# Altium schematic sheet Mechanical and Interconnect.SchDoc: Mechanical & Interconnect
size 420 x 297 mm; Address1: CryptUS; Address3: Pascal-Emmanuel Lachance; SheetNumber: 3; SheetTotal: 12
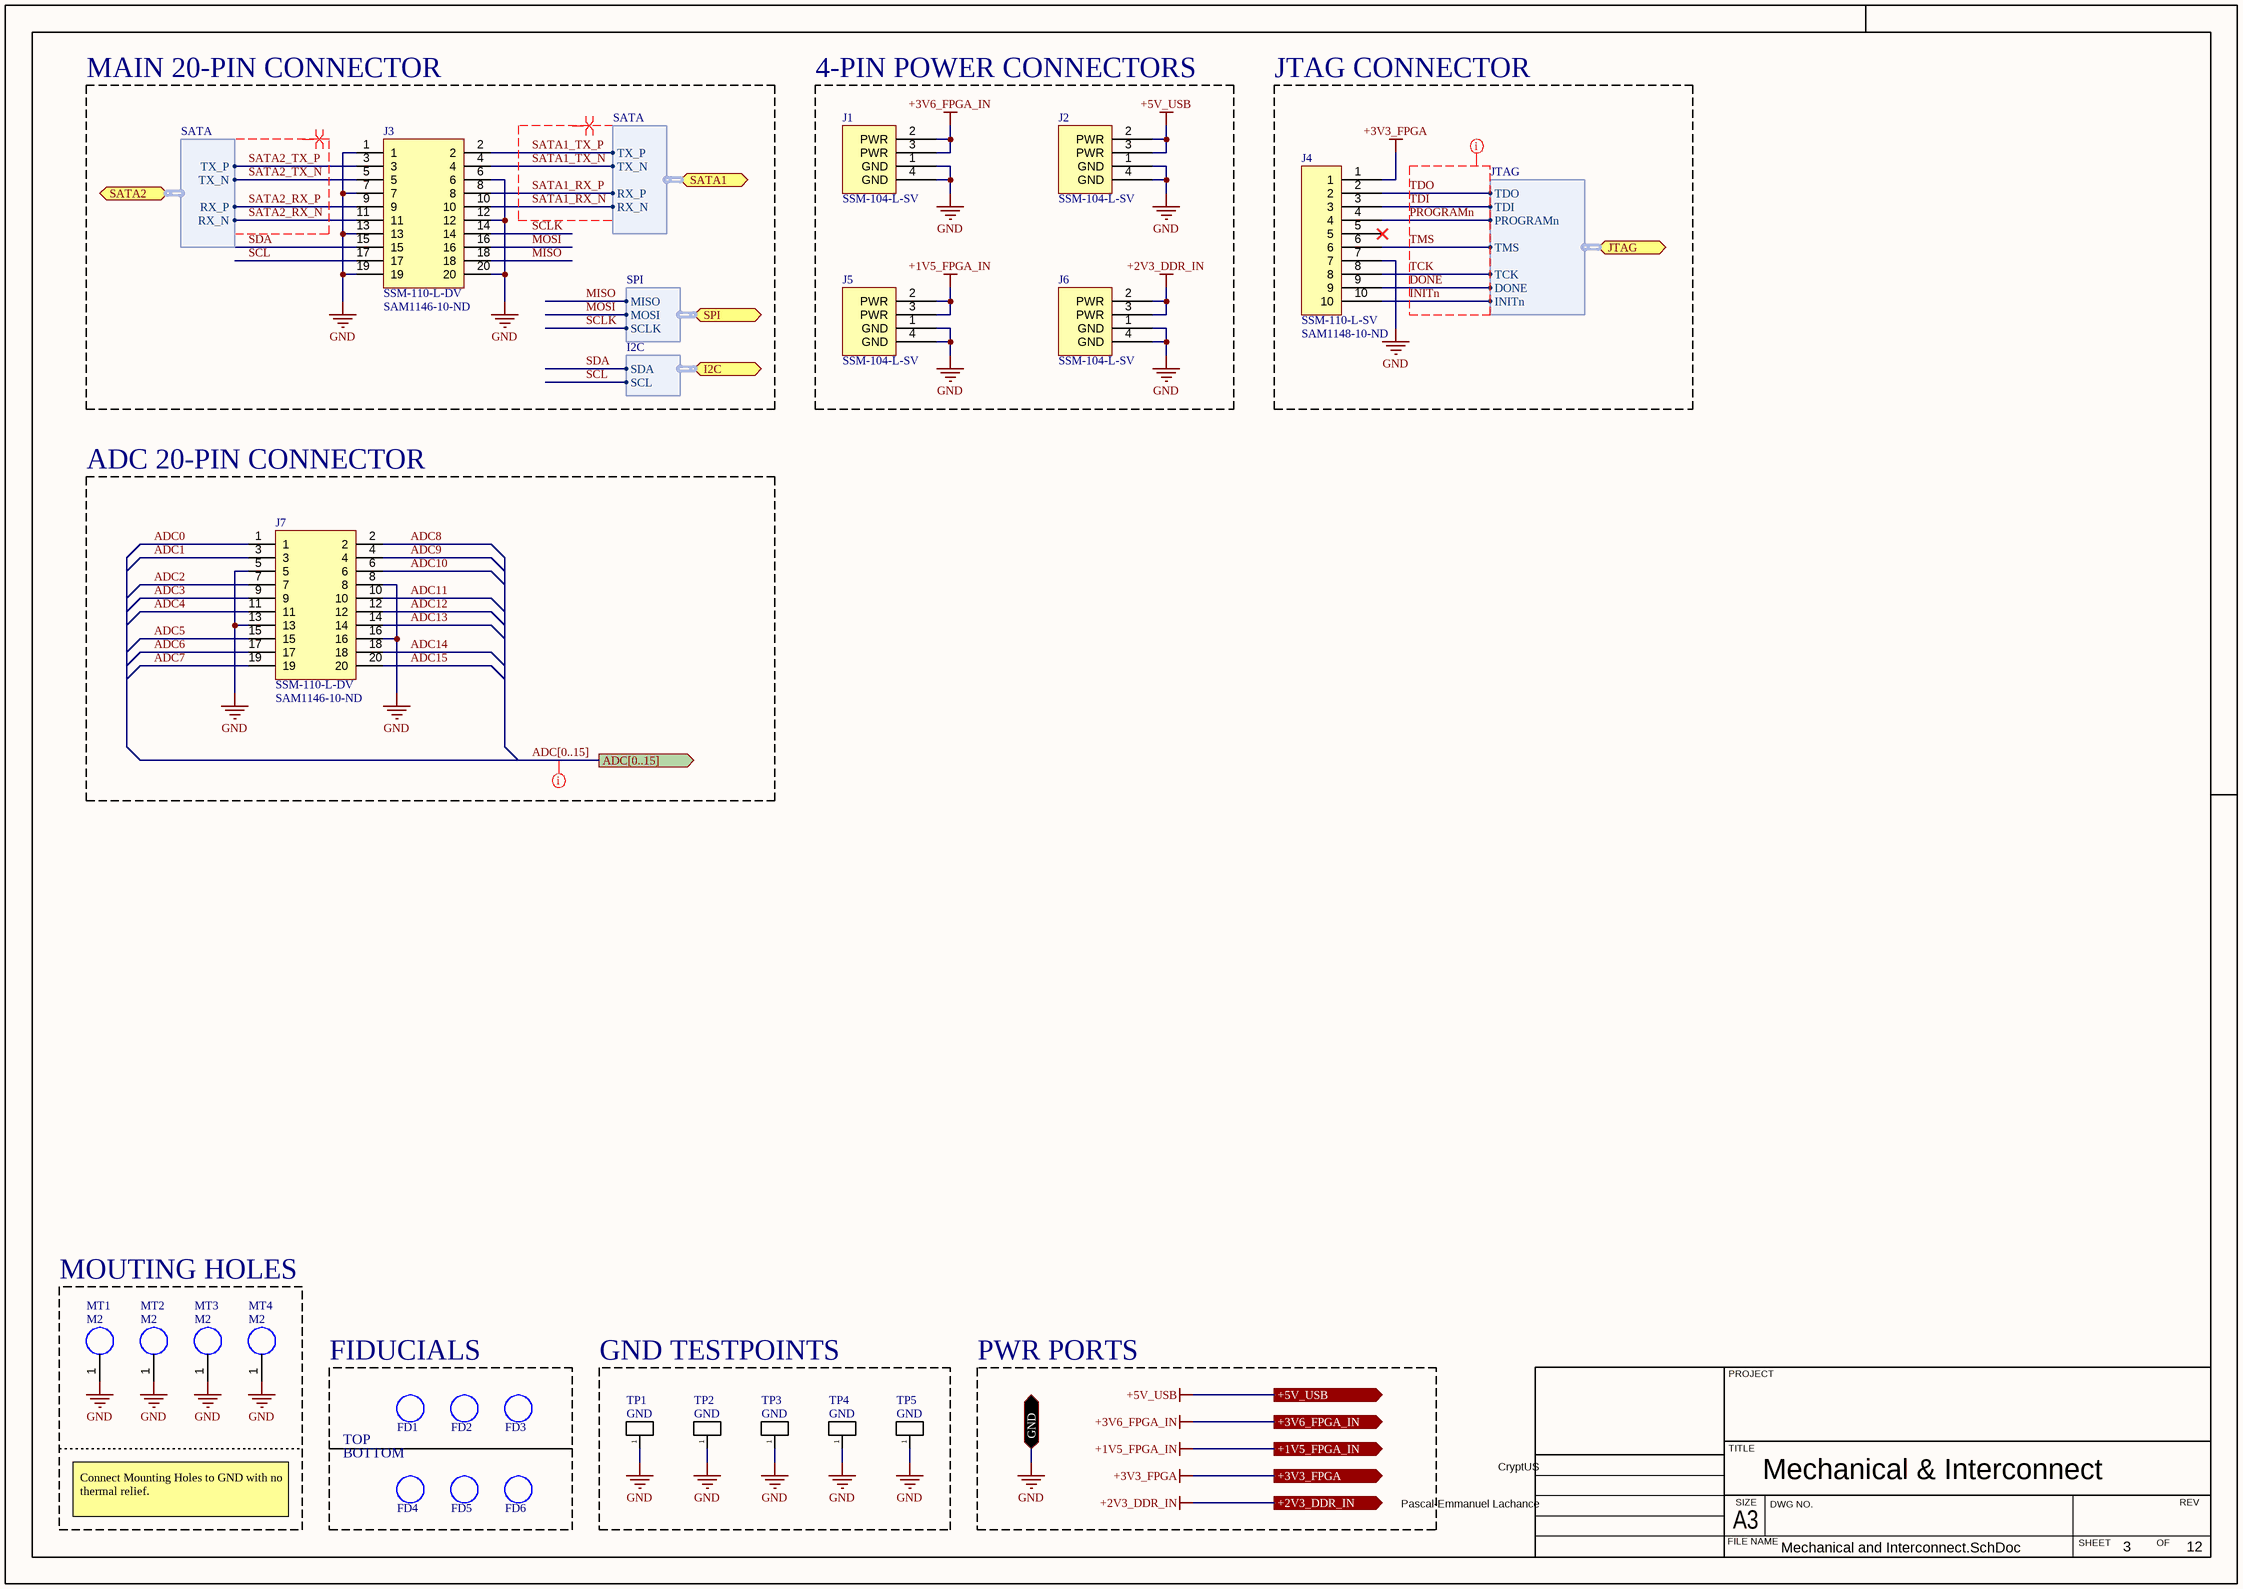
[diagram p0: Mechanical and Interconnect.SchDoc]

## Parts
FD1  FIDUCIAL  [FIDUCIAL]  (value not drawn)  (no BOM)
FD2  FIDUCIAL  [FIDUCIAL]  (value not drawn)  (no BOM)
FD3  FIDUCIAL  [FIDUCIAL]  (value not drawn)  (no BOM)
FD4  FIDUCIAL  [FIDUCIAL]  (value not drawn)  (no BOM)
FD5  FIDUCIAL  [FIDUCIAL]  (value not drawn)  (no BOM)
FD6  FIDUCIAL  [FIDUCIAL]  (value not drawn)  (no BOM)
J1  SSM-104-L-SV  [SSM-104-L-SV]
J2  SSM-104-L-SV  [SSM-104-L-SV]
J3  SSM-110-L-DV  Supplier Part Number 1: SAM1146-10-ND  [SSM-110-L-DV]
J4  SSM-110-L-SV  Supplier Part Number 1: SAM1148-10-ND  [SSM-110-L-SV]
J5  SSM-104-L-SV  [SSM-104-L-SV]
J6  SSM-104-L-SV  [SSM-104-L-SV]
J7  SSM-110-L-DV  Supplier Part Number 1: SAM1146-10-ND  [SSM-110-L-DV]
MT1  M2  [MTH_M2]
MT2  M2  [MTH_M2]
MT3  M2  [MTH_M2]
MT4  M2  [MTH_M2]
TP1  GND  [TP_HOLE]  (no BOM)
TP2  GND  [TP_HOLE]  (no BOM)
TP3  GND  [TP_HOLE]  (no BOM)
TP4  GND  [TP_HOLE]  (no BOM)
TP5  GND  [TP_HOLE]  (no BOM)

## Blocks framed on the sheet
MAIN 20-PIN CONNECTOR: J3
4-PIN POWER CONNECTORS: J1 J2 J5 J6
JTAG CONNECTOR: J4
ADC 20-PIN CONNECTOR: J7
MOUTING HOLES: MT1-MT4
FIDUCIALS: FD1-FD6
GND TESTPOINTS: TP1-TP5

## Ports
+1V5_FPGA_IN (out), +2V3_DDR_IN (out), +3V3_FPGA (out), +3V6_FPGA_IN (out), +5V_USB (out), ADC[0..15] (out), GND (bidir), I2C (bidir, harness I2C), JTAG (bidir, harness JTAG), SATA1 (bidir, harness SATA), SATA2 (bidir, harness SATA), SPI (bidir, harness SPI)

## Harnesses
JTAG: TDO, TDI, PROGRAMn, TMS, TCK, DONE, INITn
SATA: TX_P, TX_N, RX_P, RX_N
SPI: MISO, MOSI, SCLK
I2C: SDA, SCL

## Nets
+1V5_FPGA_IN: J5.2(PWR) J5.3(PWR) ; port +1V5_FPGA_IN
+2V3_DDR_IN: J6.2(PWR) J6.3(PWR) ; port +2V3_DDR_IN
+3V3_FPGA: J4.1 ; port +3V3_FPGA
+3V6_FPGA_IN: J1.2(PWR) J1.3(PWR) ; port +3V6_FPGA_IN
+5V_USB: J2.2(PWR) J2.3(PWR) ; port +5V_USB
GND: J1.1(GND) J1.4(GND) J2.1(GND) J2.4(GND) J3.1 J3.6 J3.7 J3.12 J3.13 J3.19 J3.20 J4.7 J5.1(GND) J5.4(GND) J6.1(GND) J6.4(GND) J7.5 J7.8 J7.13 J7.16 MT1.1 MT2.1 MT3.1 MT4.1 TP1.1(A) TP2.1(A) TP3.1(A) TP4.1(A) TP5.1(A) ; port GND
ADC0: J7.1
ADC1: J7.3
ADC2: J7.7
ADC3: J7.9
ADC4: J7.11
ADC5: J7.15
ADC6: J7.17
ADC7: J7.19
ADC8: J7.2
ADC9: J7.4
ADC10: J7.6
ADC11: J7.10
ADC12: J7.12
ADC13: J7.14
ADC14: J7.18
ADC15: J7.20
DONE: J4.9 ; port JTAG.DONE
INITn: J4.10 ; port JTAG.INITn
MISO: J3.18 ; port SPI.MISO
MOSI: J3.16 ; port SPI.MOSI
PROGRAMn: J4.4 ; port JTAG.PROGRAMn
SATA1_RX_N: J3.10 ; port SATA1.RX_N
SATA1_RX_P: J3.8 ; port SATA1.RX_P
SATA1_TX_N: J3.4 ; port SATA1.TX_N
SATA1_TX_P: J3.2 ; port SATA1.TX_P
SATA2_RX_N: J3.11 ; port SATA2.RX_N
SATA2_RX_P: J3.9 ; port SATA2.RX_P
SATA2_TX_N: J3.5 ; port SATA2.TX_N
SATA2_TX_P: J3.3 ; port SATA2.TX_P
SCL: J3.17 ; port I2C.SCL
SCLK: J3.14 ; port SPI.SCLK
SDA: J3.15 ; port I2C.SDA
TCK: J4.8 ; port JTAG.TCK
TDI: J4.3 ; port JTAG.TDI
TDO: J4.2 ; port JTAG.TDO
TMS: J4.6 ; port JTAG.TMS

Not connected (* = marked no-connect by the designer): J4 5*

## Buses and harness runs
bus ADC[0..15] = port ADC[0..15]

## Layout directives
differential pair; net class SATA: SATA1_RX_N, SATA1_RX_P, SATA1_TX_N, SATA1_TX_P, SATA2_RX_N, SATA2_RX_P, SATA2_TX_N, SATA2_TX_P
net class JTAG: DONE, INITn, PROGRAMn, TCK, TDI, TDO, TMS
net class ADC: (no net found under the mark)

## Notes on the sheet
- PWR PORTS
- (near FD4) BOTTOM
- TOP
- Connect Mounting Holes to GND with no thermal relief.
- PROJECT
- TITLE
- FILE NAME
- A3
- SIZE
- DWG NO.
- SHEET
- OF
- REV

## Library data of the parts
J1 J2 J5 J6 = CONN_SSM-104-L-SV: CONN RCPT 4POS 0.1 GOLD SMD; Mfr: Samtec Inc.; Number of positions: 4; Pitch: 100mil; Current: 5.2A / contact; Insulation Height: 290mil; Operating Temperature: -55C - 125C
J3 J7 = CONN_SSM-110-L-DV: Mfr: Samtech Inc.; Number of positions: 20; Pitch: 100mils; Current Rating: 5.2A per contact; Voltage Rating: 405VAC, 572VDC; Number of rows: 2; Mounting Type: Surface Mount; Insulation Height: 290mils; Operating Temperature: -55C - 125C; Supplier 1: Digi-Key
J4 = CONN_SSM-110-L-SV: CONN RCPT 10POS 0.1 GOLD SMD; Mfr: Samtec Inc.; Number of positions: 10; Pitch: 100mil; Current: 5.2A / contact; Insulation Height: 290mil; Operating Temperature: -55C - 125C; Supplier 1: Digi-Key
MT1-MT4 = MOUNTING_HOLE
TP1-TP5 = TESTPOINT: Test Point